# EasyEDA schematic SCH_RMB-Frankenboard_2024-09-02.json
TITLE: RMB-Frankenboard; REV: 4; Date: 13-8-2024; Sheet: 1/1; Company: Team C.R.A.P
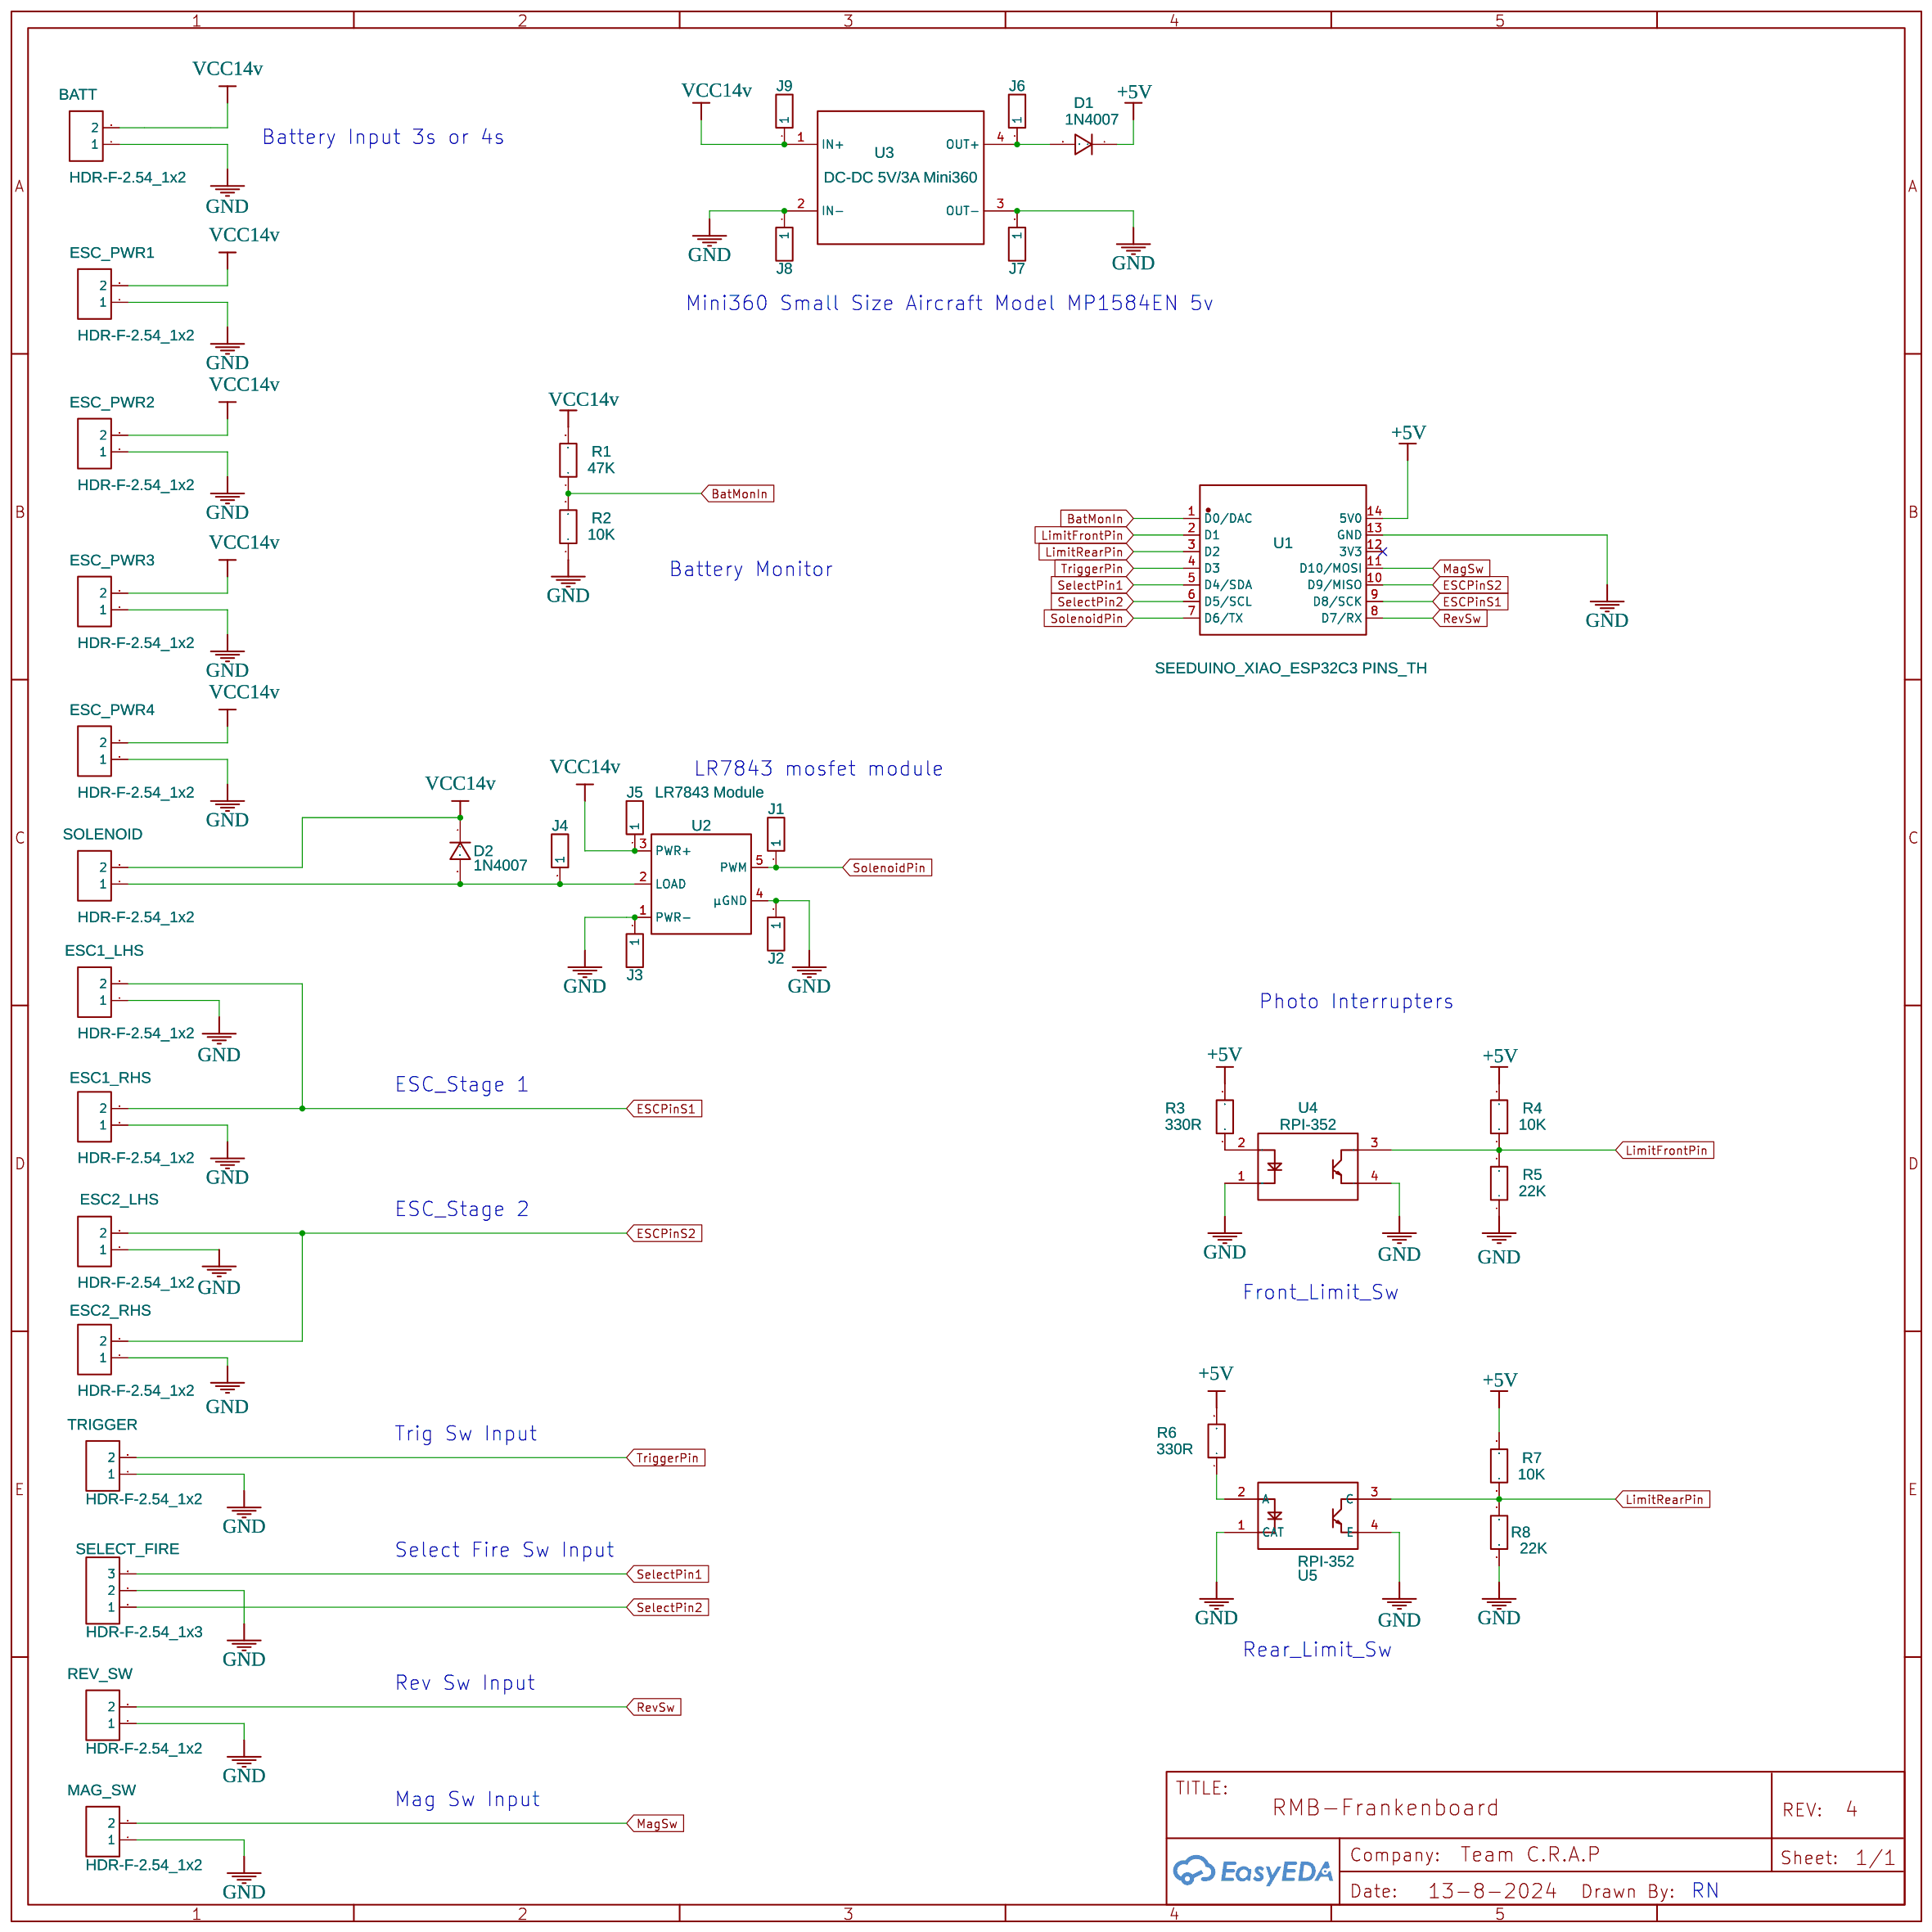
[diagram p0: schematic sheet]

## Parts
BATT  HDR-F-2.54_1x2  [2 PADS 5X5MM WITH 10X12MM OUTLINE]
D1  1N4007  [DO-41_BD2.4-L4.7-P8.70-D0.9-RD]
D2  1N4007  [DO-41_BD2.4-L4.7-P8.70-D0.9-RD]
ESC1_LHS  HDR-F-2.54_1x2  [HDR-M-2.54_1X2]
ESC1_RHS  HDR-F-2.54_1x2  [HDR-M-2.54_1X2]
ESC2_LHS  HDR-F-2.54_1x2  [HDR-M-2.54_1X2]
ESC2_RHS  HDR-F-2.54_1x2  [HDR-M-2.54_1X2]
ESC_PWR1  HDR-F-2.54_1x2  [2 PADS 5X5MM WITH 10X12MM OUTLINE]
ESC_PWR2  HDR-F-2.54_1x2  [2 PADS 5X5MM WITH 10X12MM OUTLINE]
ESC_PWR3  HDR-F-2.54_1x2  [2 PADS 5X5MM WITH 10X12MM OUTLINE]
ESC_PWR4  HDR-F-2.54_1x2  [2 PADS 5X5MM WITH 10X12MM OUTLINE]
J1  HDR-M-2.54_1x1  [HDR-M-2.54_1X1]
J2  HDR-M-2.54_1x1  [HDR-M-2.54_1X1]
J3  HDR-M-2.54_1x1  [HDR-M-2.54_1X1]
J4  HDR-M-2.54_1x1  [HDR-M-2.54_1X1]
J5  HDR-M-2.54_1x1  [HDR-M-2.54_1X1]
J6  HDR-M-2.54_1x1  [HDR-M-2.54_1X1]
J7  HDR-M-2.54_1x1  [HDR-M-2.54_1X1]
J8  HDR-M-2.54_1x1  [HDR-M-2.54_1X1]
J9  HDR-M-2.54_1x1  [HDR-M-2.54_1X1]
MAG_SW  HDR-F-2.54_1x2  [HDR-M-2.54_1X2]
R1  47K  [R_AXIAL-0.3]
R2  10K  [R_AXIAL-0.3]
R3  330R  [R_AXIAL-0.3]
R4  10K  [R_AXIAL-0.3]
R5  22K  [R_AXIAL-0.3]
R6  330R  [R_AXIAL-0.3]
R7  10K  [R_AXIAL-0.3]
R8  22K  [R_AXIAL-0.3]
REV_SW  HDR-F-2.54_1x2  [HDR-M-2.54_1X2]
SELECT_FIRE  HDR-F-2.54_1x3  [HDR-M-2.54_1X3]
SOLENOID  HDR-F-2.54_1x2  [2 PADS 5X5MM WITH 10X12MM OUTLINE RN]
TRIGGER  HDR-F-2.54_1x2  [HDR-M-2.54_1X2]
U1  SEEDUINO_XIAO_ESP32C3 PINS_TH  [SEEDUINO_XIAO_ESP32C3_PINS]
U2  LR7843 Module  [LR7843-MODULE]
U3  DC-DC 5V/3A Mini360  [DC-DC 5V/3A MINI360]
U4  RPI-352  [OPTO-TH_RPI-352]
U5  RPI-352  [OPTO-TH_RPI-352]

## Library data of the parts
BATT ESC_PWR1-ESC_PWR4 SOLENOID = HDR-F-2.54_1x2: Supplier Part: C49661; Supplier: LCSC; Contributor: LCEDA_Lib; Package Display: No
D1 D2 = 1N4007: Supplier: LCSC; Manufacturer: SEMTECH; Supplier Part: C106903; Contributor: LCEDA_Lib
ESC1_LHS ESC1_RHS ESC2_LHS ESC2_RHS MAG_SW REV_SW TRIGGER = HDR-F-2.54_1x2: Supplier Part: C49661; Supplier: LCSC; Contributor: LCEDA_Lib
J1-J9 = HDR-M-2.54_1x1: Supplier Part: C81276; Supplier: LCSC; Contributor: LCEDA_Lib
R1-R3 R6 = R_AXIAL-0.3_EU: Contributor: LCEDA_Lib
R4 R5 R7 R8 = R_0603_EU: Contributor: LCEDA_Lib
SELECT_FIRE = HDR-F-2.54_1x3: Supplier Part: C146690; Supplier: LCSC; Contributor: LCEDA_Lib
U1 = SEEDUINO_XIAO_ESP32C3 PINS_TH: Contributor: anandj
U2 = LR7843 Module: Contributor: eriochrome
U3 = DC-DC 5V/3A Mini360: Manufacturer: Generic; Manufacturer Part: Aircraft Model MP1584EN Power Module; Supplier Part: MP1584EN; Contributor: samm928
U4 U5 = RPI-352: Supplier: LCSC; Manufacturer: ROHM(罗姆); Supplier Part: C79953; JLCPCB Part Class: Extended Part; link: https://lcsc.com/eda_search?q=C79953&%26type=1&ref=editor

## Nets
+5V: D1.1 R3.2 R4.2 R6.2 R7.2 U1.14(5V0)
GND: BATT.1 ESC1_LHS.1 ESC1_RHS.1 ESC2_LHS.1 ESC2_RHS.1 ESC_PWR1.1 ESC_PWR2.1 ESC_PWR3.1 ESC_PWR4.1 J2.1 J3.1 J7.1 J8.1 MAG_SW.1 R2.1 R5.1 R8.1 REV_SW.1 SELECT_FIRE.2 TRIGGER.1 U1.13(GND) U2.1(PWR-) U2.4(μGND) U3.2(IN-) U3.3(OUT-) U4.1(CAT) U4.4(E) U5.1(CAT) U5.4(E)
VCC14v: BATT.2 D2.1 ESC_PWR1.2 ESC_PWR2.2 ESC_PWR3.2 ESC_PWR4.2 J5.1 J9.1 R1.2 SOLENOID.2 U2.3(PWR+) U3.1(IN+)
BatMonIn: R1.1 R2.2 U1.1(D0/DAC)
ESCPinS1: ESC1_LHS.2 ESC1_RHS.2 U1.9(D8/SCK)
ESCPinS2: ESC2_LHS.2 ESC2_RHS.2 U1.10(D9/MISO)
LimitFrontPin: R4.1 R5.2 U1.2(D1) U4.3(C)
LimitRearPin: R7.1 R8.2 U1.3(D2) U5.3(C)
MagSw: MAG_SW.2 U1.11(D10/MOSI)
RevSw: REV_SW.2 U1.8(D7/RX)
SelectPin1: SELECT_FIRE.3 U1.5(D4/SDA)
SelectPin2: SELECT_FIRE.1 U1.6(D5/SCL)
SolenoidPin: J1.1 U1.7(D6/TX) U2.5(PWM)
TriggerPin: TRIGGER.2 U1.4(D3)
Net-(D1-2): D1.2 J6.1 U3.4(OUT+)
Net-(D2-2): D2.2 J4.1 SOLENOID.1 U2.2(LOAD)
Net-(R3-1): R3.1 U4.2(A)
Net-(R6-1): R6.1 U5.2(A)

Not connected (* = marked no-connect by the designer): U1 12(3V3)*

## Notes on the sheet
- Battery Input 3s or 4s
- Mini360 Small Size Aircraft Model MP1584EN 5v
- Battery Monitor
- LR7843 mosfet module
- Photo Interrupters
- ESC_Stage 1
- ESC_Stage 2
- Front_Limit_Sw
- Trig Sw Input
- Select Fire Sw Input
- Rear_Limit_Sw
- Rev Sw Input
- Mag Sw Input
- RN
